# Altium schematic sheet Sheet1.SchDoc
size A; SheetNumber: 1; SheetTotal: 1
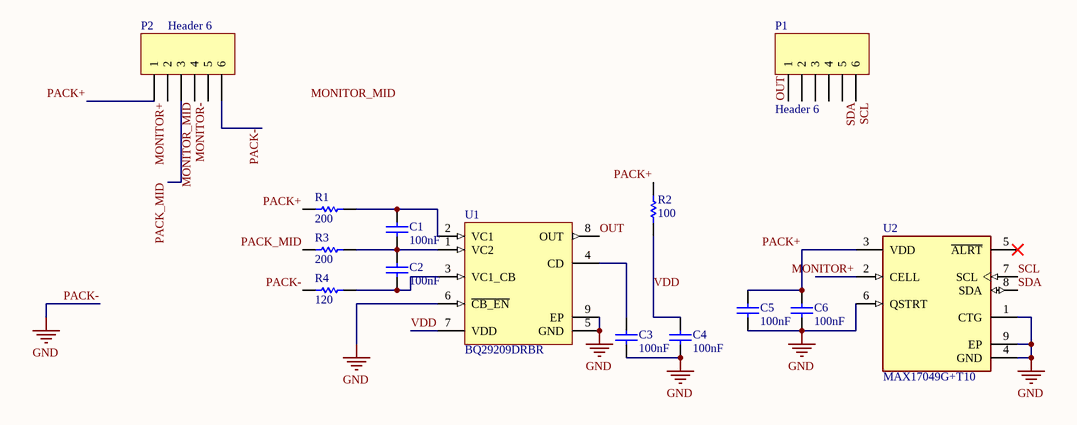
[diagram p0: Sheet1.SchDoc]

## Parts
C1  Capacitance: 100nF  [CAPC2013X135X45ML10T25]  (hidden comment: GRM21BR71H104KA01L)
C2  Capacitance: 100nF  [CAPC2013X135X45ML10T25]  (hidden comment: GRM21BR71H104KA01L)
C3  Capacitance: 100nF  [CAPC2013X135X45ML10T25]  (hidden comment: GRM21BR71H104KA01L)
C4  Capacitance: 100nF  [CAPC2013X135X45ML10T25]  (hidden comment: GRM21BR71H104KA01L)
C5  Capacitance: 100nF  [CAPC2013X135X45ML10T25]  (hidden comment: GRM21BR71H104KA01L)
C6  Capacitance: 100nF  [CAPC2013X135X45ML10T25]  (hidden comment: GRM21BR71H104KA01L)
P1  Header 6  [HDR1X6]
P2  Header 6  [HDR1X6]
R1  R: 200  [RESC2013X50X30ML20T20]  (hidden comment: CRCW0805200RJNEA)
R2  r: 100  [RESC2013X50X30NL20T20]  (hidden comment: CRCW0805100RFKEA)
R3  R: 200  [RESC2013X50X30ML20T20]  (hidden comment: CRCW0805200RJNEA)
R4  R: 120  [RESC2013X70X40NL20T20]  (hidden comment: ERJ-6ENF1200V)
U1  BQ29209DRBR  [DRB0008B_V]
U2  MAX17049G+T10  [FP-T822-3-MFG]

## Nets
PACK-: C3.1 C4.1 C5.2 C6.1 P2.6 R4.1 U1.5(GND) U1.6(~{CB_EN}) U1.9(EP) U2.1(CTG) U2.4(GND) U2.6(QSTRT) U2.9(EP)  [also labelled GND]
MONITOR+: P2.2 U2.2(CELL)
MONITOR-: P2.5
MONITOR_MID: P2.4
OUT: P1.1 U1.8(OUT)
PACK+: C5.1 C6.2 P2.1 R1.1 R2.2 U2.3(VDD)
PACK_MID: P2.3 R3.1
SCL: P1.6 U2.7(SCL)
SDA: P1.5 U2.8(SDA)
VDD: C4.2 R2.1 U1.7(VDD)
NetC1_1: C1.1 C2.2 R3.2 U1.1(VC2)
NetC1_2: C1.2 R1.2 U1.2(VC1)
NetC2_1: C2.1 R4.2 U1.3(VC1_CB)
NetC3_2: C3.2 U1.4(CD)

Not connected (* = marked no-connect by the designer): P1 2 3 4; U2 5(~{ALRT})*

## Notes on the sheet
- Labels drawn without touching a wire or pin: MONITOR_MID

## Library data of the parts
C1-C6 = CMP-2100-03644-1: Chip Capacitor, 0.1 uF, +/- 10%, 50 V, -55 to 125 degC, 0805 (2012 Metric), RoHS, Tape and Reel; Manufacturer: Murata; Voltage: 50V; Insulation Resistance: 10GR; Dielectric Material: Ceramic; Dielectric: X7R; Package Description: 2-Pin Surface Mount Device, Body 2 x 1.25 mm; Manufacturer URL: http://www.murata.com/; Case Code (Imperial): 0805; Datasheet URL: http://psearch.en.murata.com/capacitor/product/GRM21BR71H104KA01%23.pdf; Termination: SMD/SMT; Lead Free: LeadFree; Package Quantity: 1; Mount: SurfaceMount; REACH SVHC: Unknown; Thickness: 0.053inch; Height: 1.25mm; Case/Package: 0805; Voltage Rating: 50V; Width: 0.049inch; Case Code (Metric): 2012; Material: Ceramic; Min Operating Temperature: -55degC; RoHSCompliant: true; Datasheet Version: 42675.0; Voltage Rating (DC): 50V; Tolerance: 10%; Package Reference: 0805; Depth: 1.25mm; Length: 2mm; Max Operating Temperature: 125degC; Packaging: TapeandReel; Number of Pins: 2; Radiation Hardening: No
P1 P2 = Header 6: Header, 6-Pin; LatestRevisionDate: 17-Jul-2002; LatestRevisionNote: Re-released for DXP Platform.; Publisher: Altium Limited
R1 R3 = CMP-2001-03664-1: Manufacturer: Vishay Dale; Part Number: CRCW0805200RJNEA
R2 = CMP-2001-04901-1: Manufacturer: Vishay Dale; Part Number: CRCW0805100RFKEA
R4 = CMP-2001-00511-5: Chip Resistor, 120 Ohm, +/- 1%, 0.125 W, -55 to 155 degC, 0805 (2012 Metric), RoHS, Tape and Reel; Manufacturer: Panasonic; Voltage Rating: 150 V; Mount: Surface Mount; ComponentLink1Description: Manufacturer URL; ComponentLink1URL: http://www.panasonic.com/; RoHSCompliant: true; Min Operating Temperature: -55 degC; Length: 2 mm; Max Operating Temperature: 155 degC; Packaging: Tape and Reel; Package Quantity: 5000; REACH SVHC: Yes; Pins: 2; ComponentLink2Description: Datasheet; DatasheetVersion: 04/2015; PackageReference: 0805; ComponentLink2URL: http://industrial.panasonic.com/cdbs/www-data/pdf/RDA0000/AOA0000C86.pdf; Mounting Technology: Surface Mount; PackageDescription: 2-Pin Surface Mount Device, Body 2 x 1.25 mm; Height: 0.6 mm; ComponentLink3Description: New link; ComponentLink3URL: *
U1 = CMP-0321-00626-2: Voltage Protection with Automatic Cell Balance for 2-Cell Li-Ion Batteries, OVP=4.3 V, -40 to 85 degC, 8-pin SON (DRB), Green (RoHS & no Sb/Br); Manufacturer: Texas Instruments; SubFamily: Lithium Ion Protection; Lead Acid: N; PackageReference: DRB0008B; Li-Ion: N; PackageVersion: revK, Jun-2012; PartNumber: BQ29209DRBR; Eco-Plan: Green (RoHS & no Sb/Br); DatasheetVersion: SLUSA52A; PackageDescription: 8-Pin Plastic Small Outline No-Lead, 3 x 3 x 1 mm Body, 0.65 mm Pitch, Exposed Pad; Li-Polymer: N; Mounting Technology: Surface Mount; Over Voltage Protection: N; NiCd: N; ComponentLink1URL: http://www.ti.com/general/docs/lit/getliterature.tsp?genericPartNumber=BQ29209&fileType=pdf; ComponentLink1Description: Datasheet; NiMH: N
U2 = CMP-05715-000114-1: IC FUEL GAUGE LI-ION 2CELL 8TDFN; Manufacturer: Maxim Integrated; Number Of Cells: 2; Standoff Height: 0mm; Max Supply Voltage: 4.5V; Nominal Supply Current: 23uA; Min Supply Voltage: 2.5V; Automotive: No; Temperature Range High: +85°C; Device Class L1: Integrated Circuits (ICs); Device Class L2: Power Management ICs; ComponentLink2Description: Datasheet; Digikey Description: IC FUEL GAUGE LI-ION 2CELL 8TDFN; Height: 0.8mm; Footprint Url: https://pdfserv.maximintegrated.com/land_patterns/90-0065.PDF; Temperature Range Low: -40°C; Octopart: https://octopart.com/max17049g%2Bt10-maxim+integrated-20327626; Package: T822-3; Temperature: -40°C to +85°C; Device Class L3: Battery Management; Manufacturer Part Number: MAX17049G+T10; Lead Free: Yes; Mouser Description: Fuel Gauge Li-Ion 8-Pin TDFN EP T/R; RoHS: TRUE; Category: IC; ComponentLink2URL: https://datasheets.maximintegrated.com/en/ds/MAX17048-MAX17049.pdf